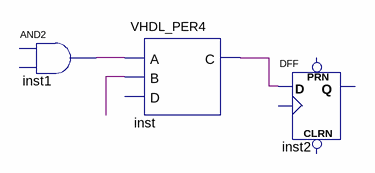
[diagram p0: schematic sheet]
// Quartus schematic Block1.bdf as structural Verilog: 3 symbols, 0 pins
module Block1 (
);

  wire inst1_out, inst_c, undriven;

  // AND2 inst1 has open pins: IN1=open, IN2=open, OUT=inst1_out
  VHDL_PER4 inst (.A(inst1_out), .B(undriven), .C(inst_c));  // open: D
  DFF inst2 (.D(inst_c));  // open: CLRN, CLK, PRN, Q
endmodule
